# EAGLE board icyradio-main (EAGLE 9.6.2), part 1 of 6
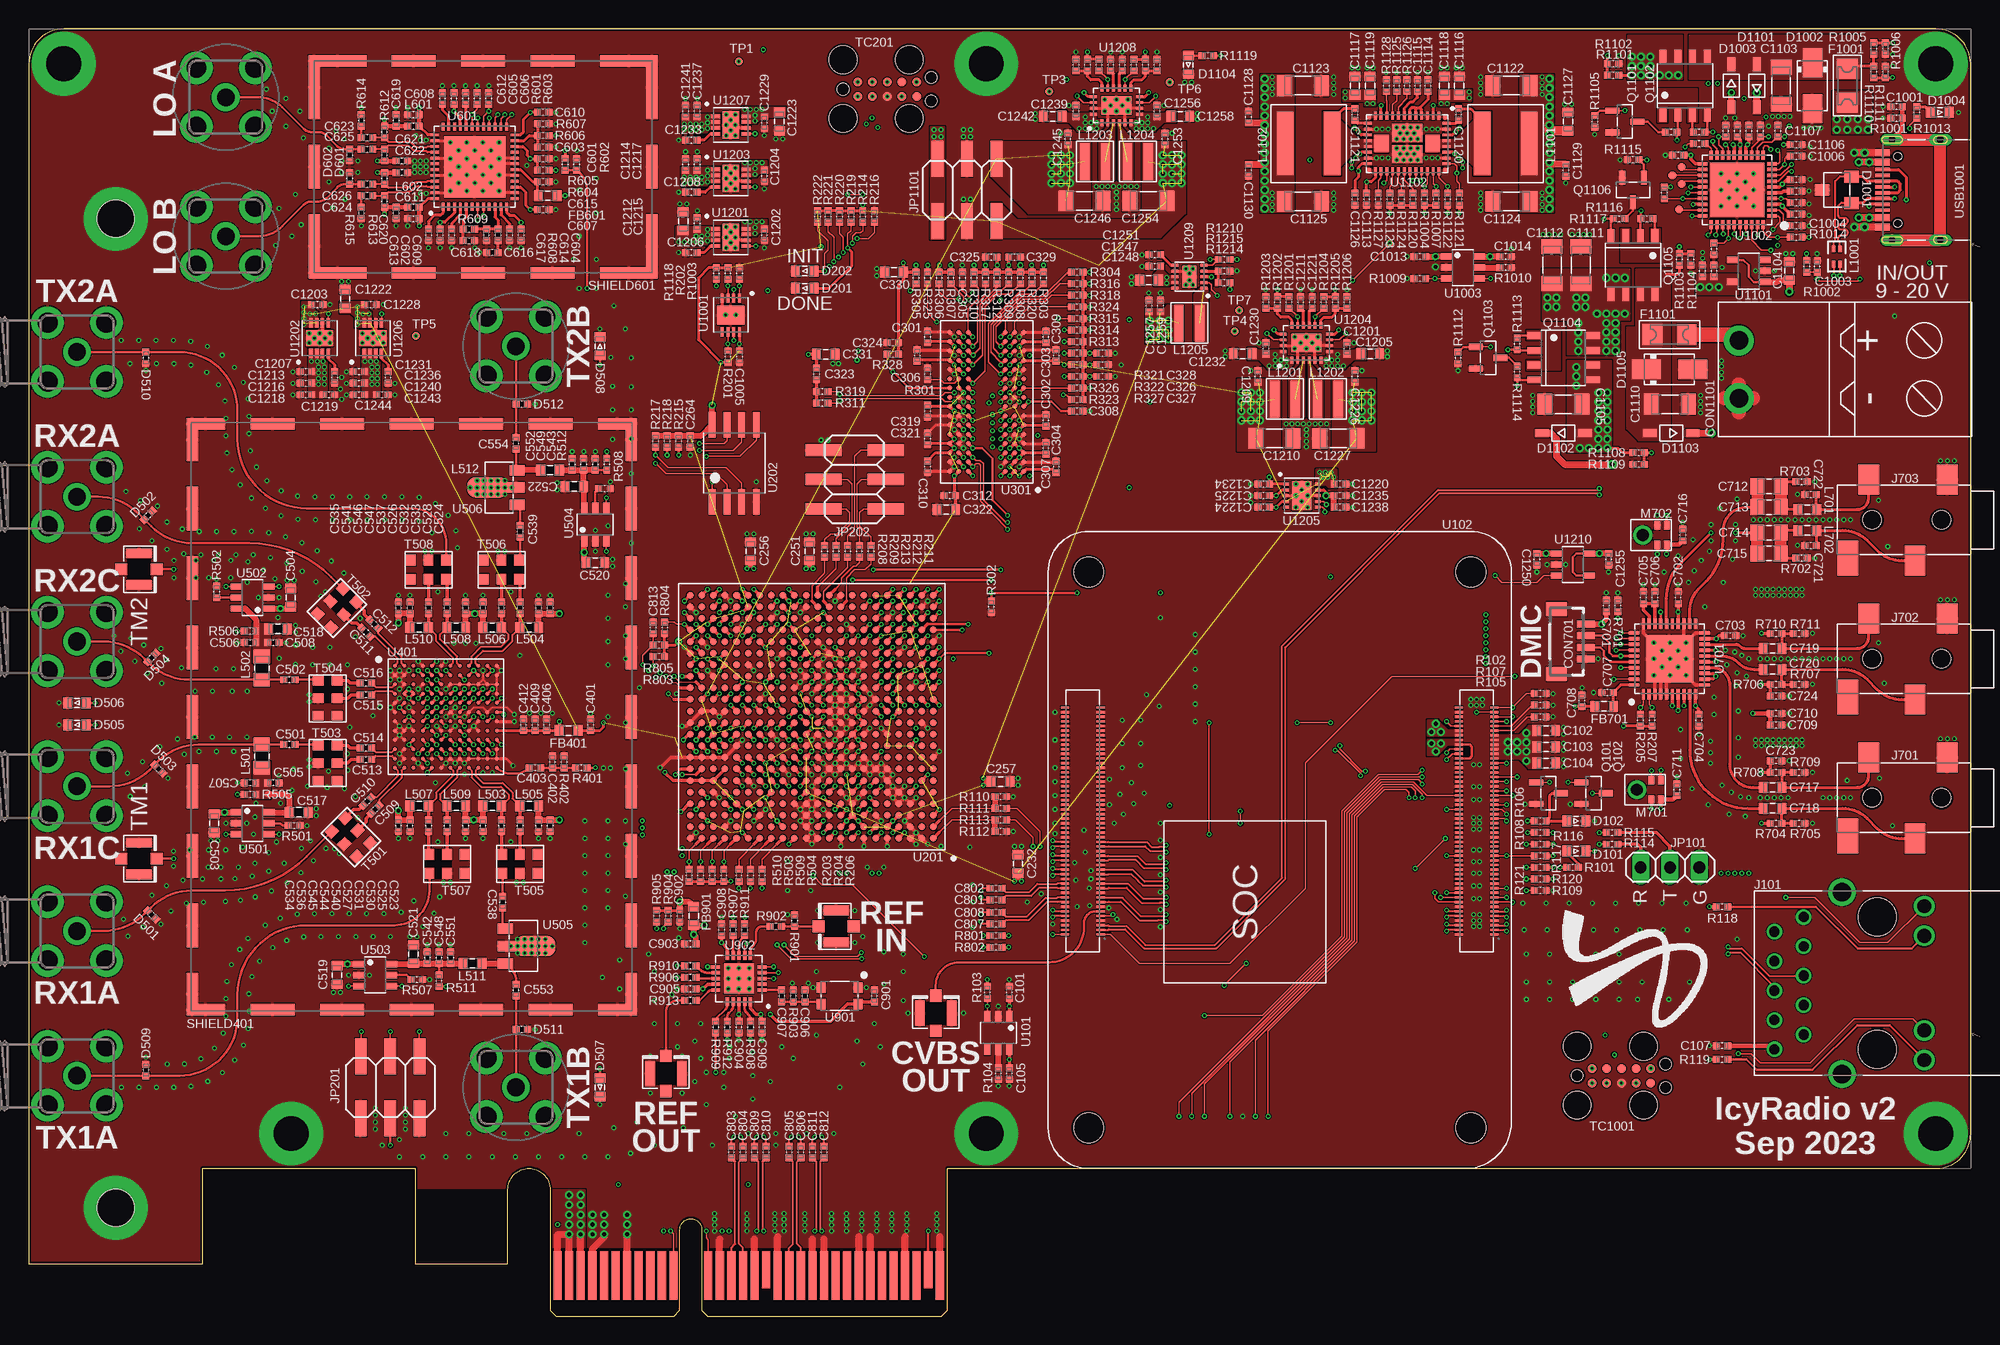
[diagram p26: board, top side]
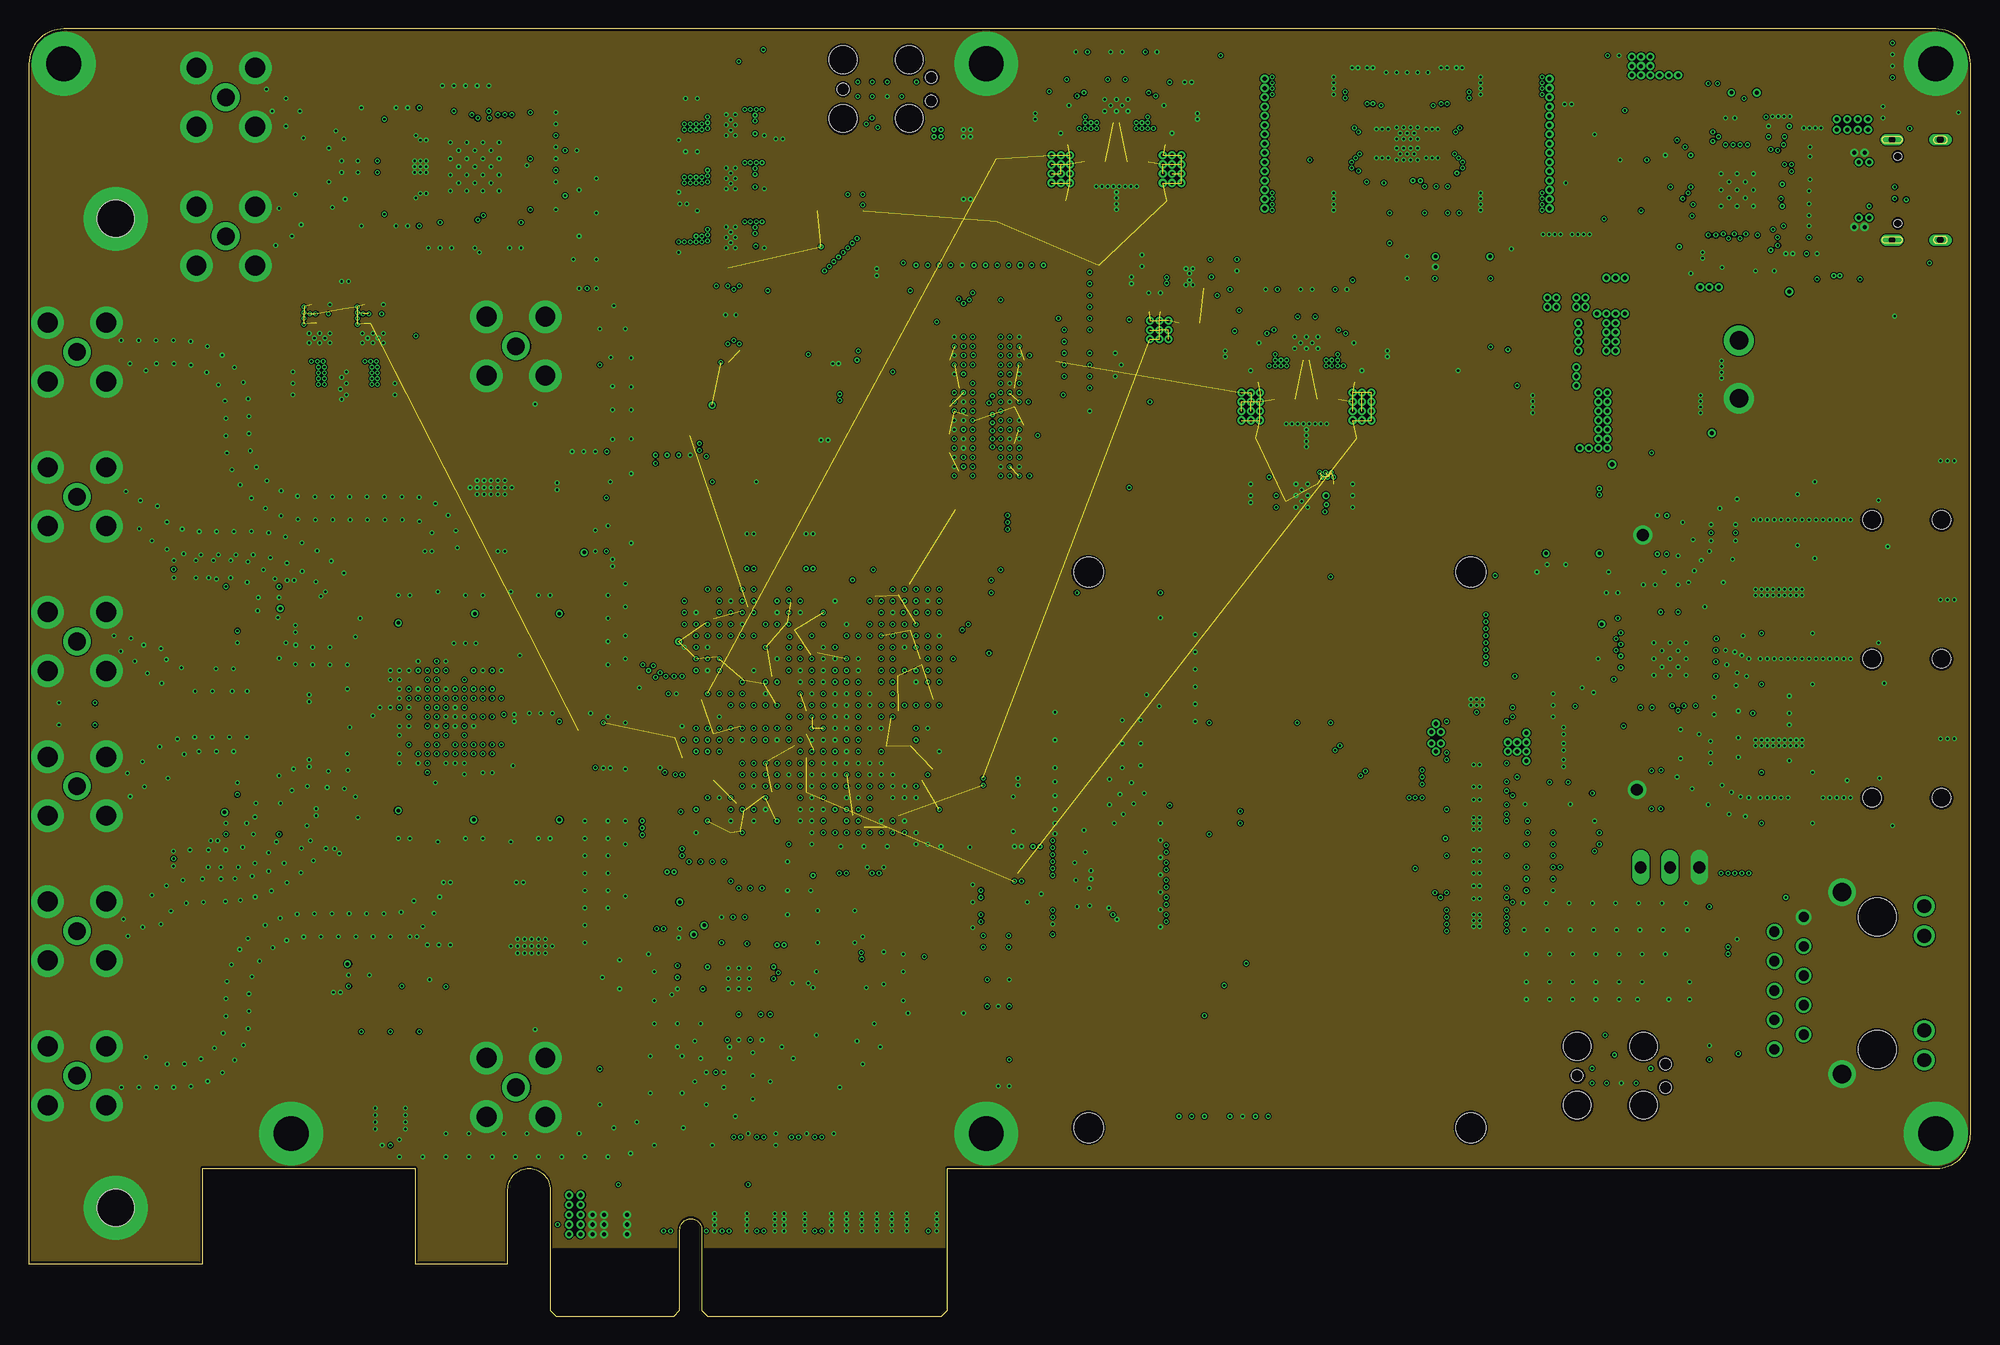
[diagram p27: board, inner layer Route2]
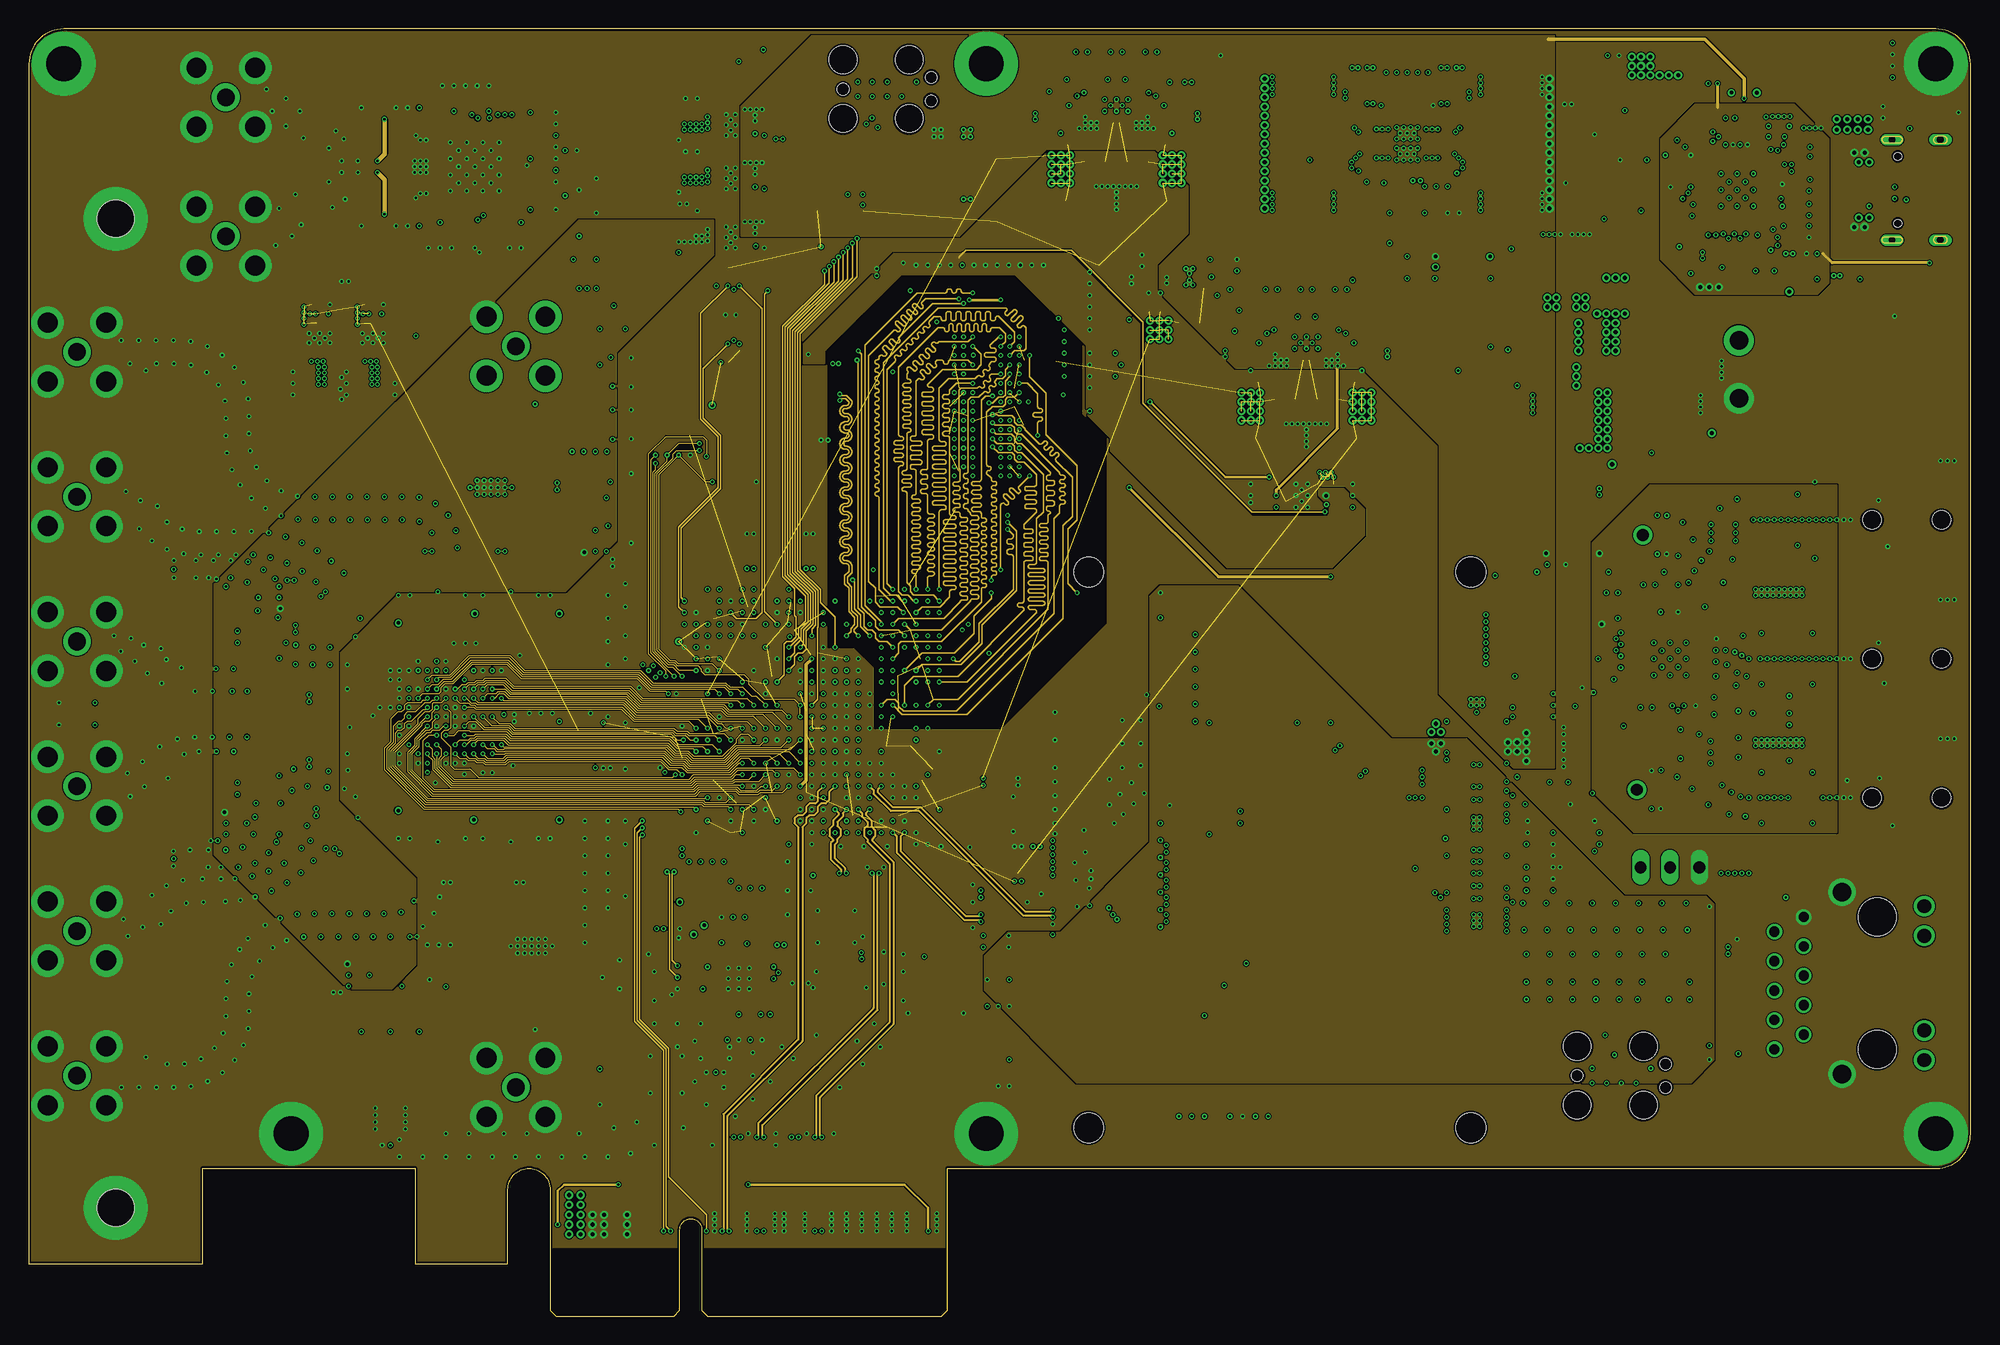
[diagram p28: board, inner layer Route3]
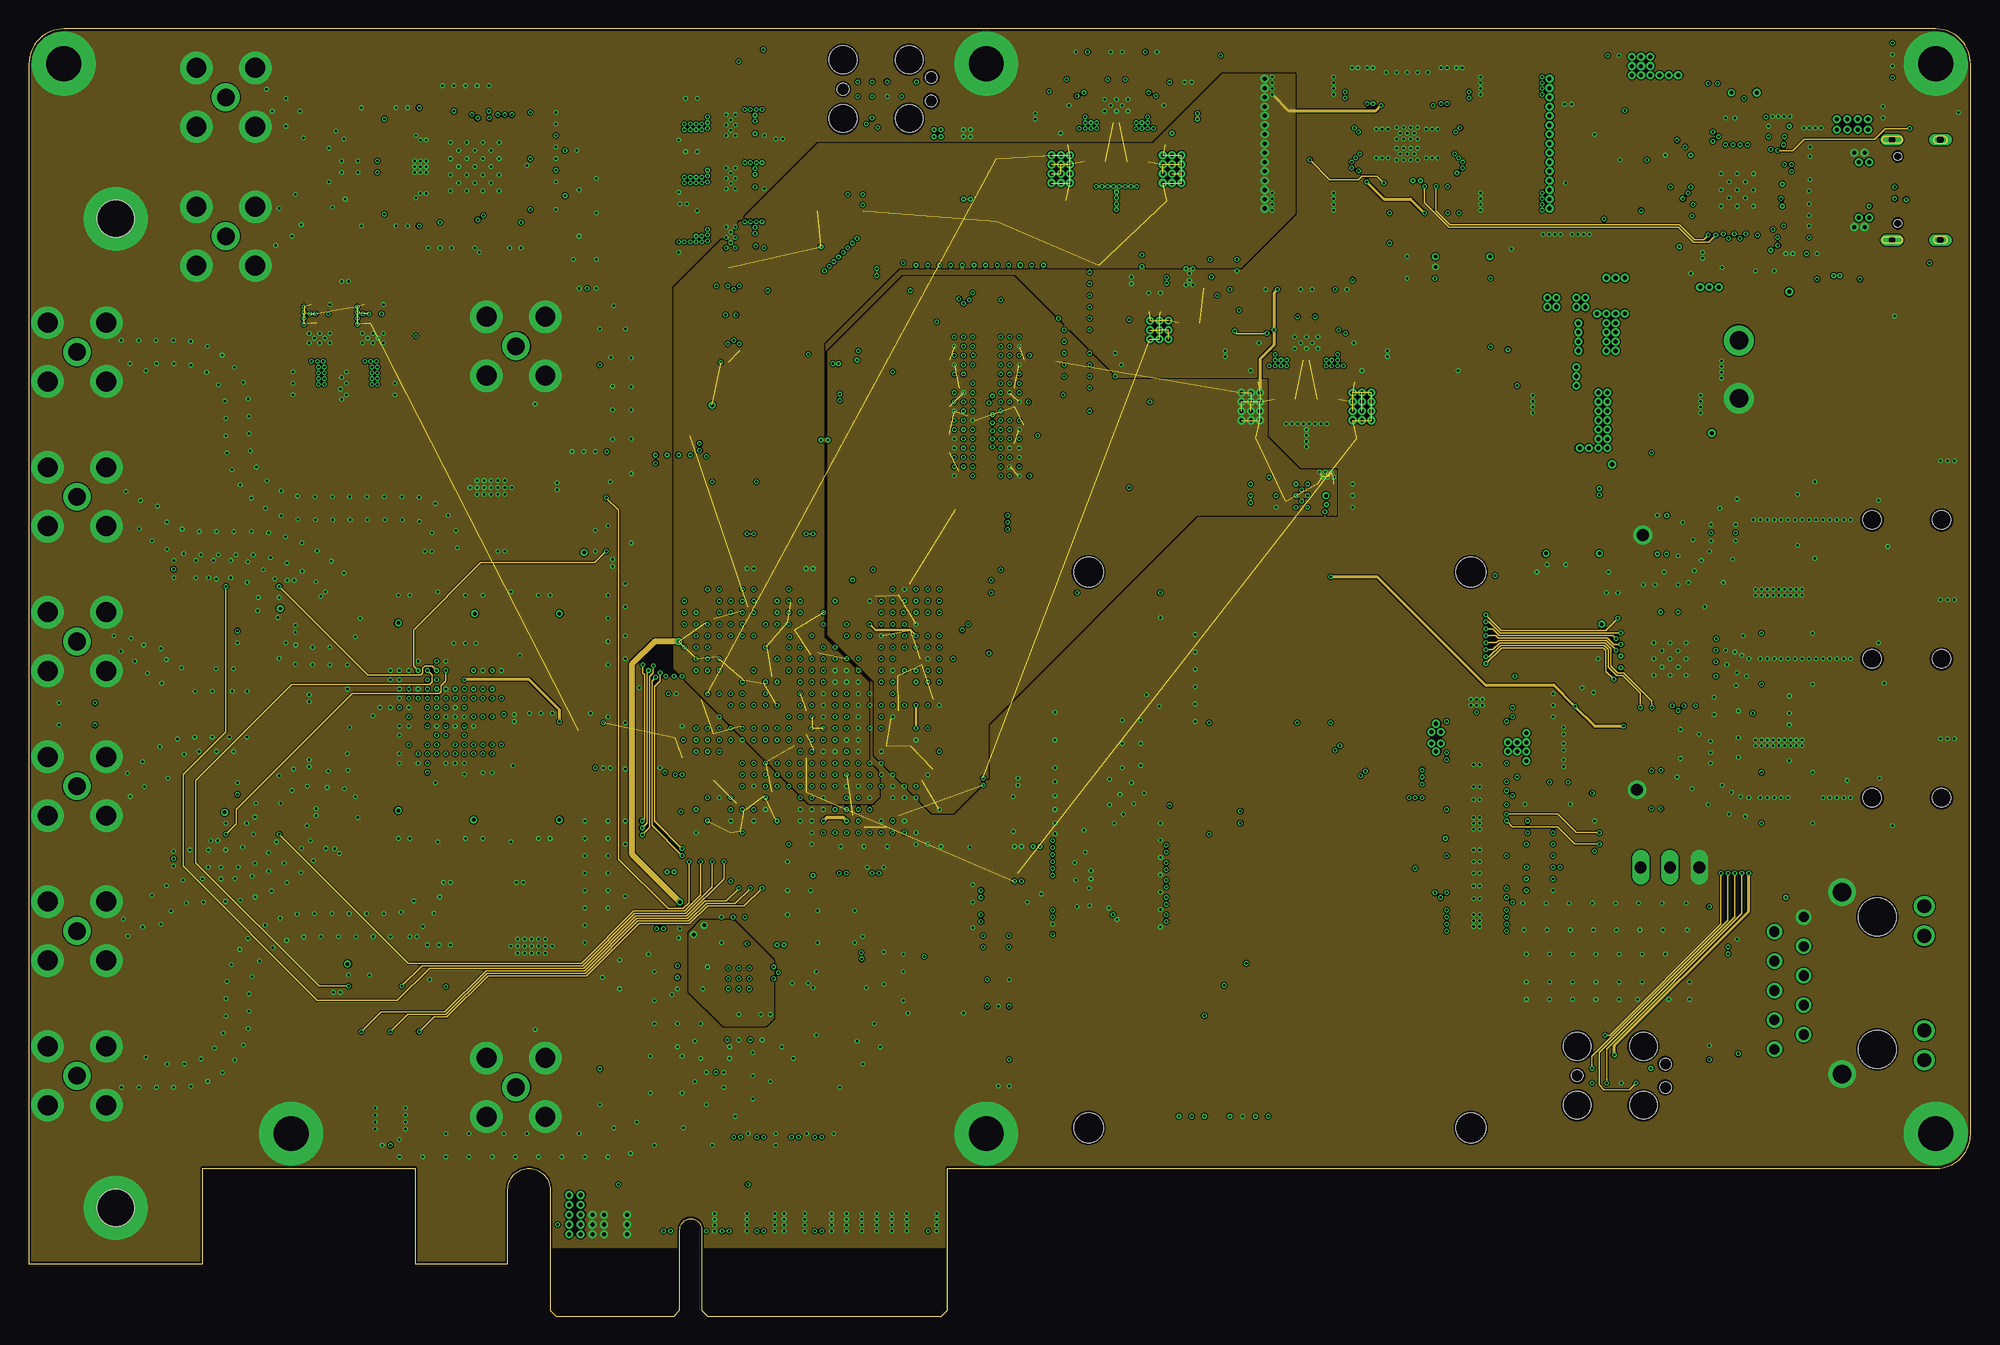
[diagram p29: board, inner layer Route14]
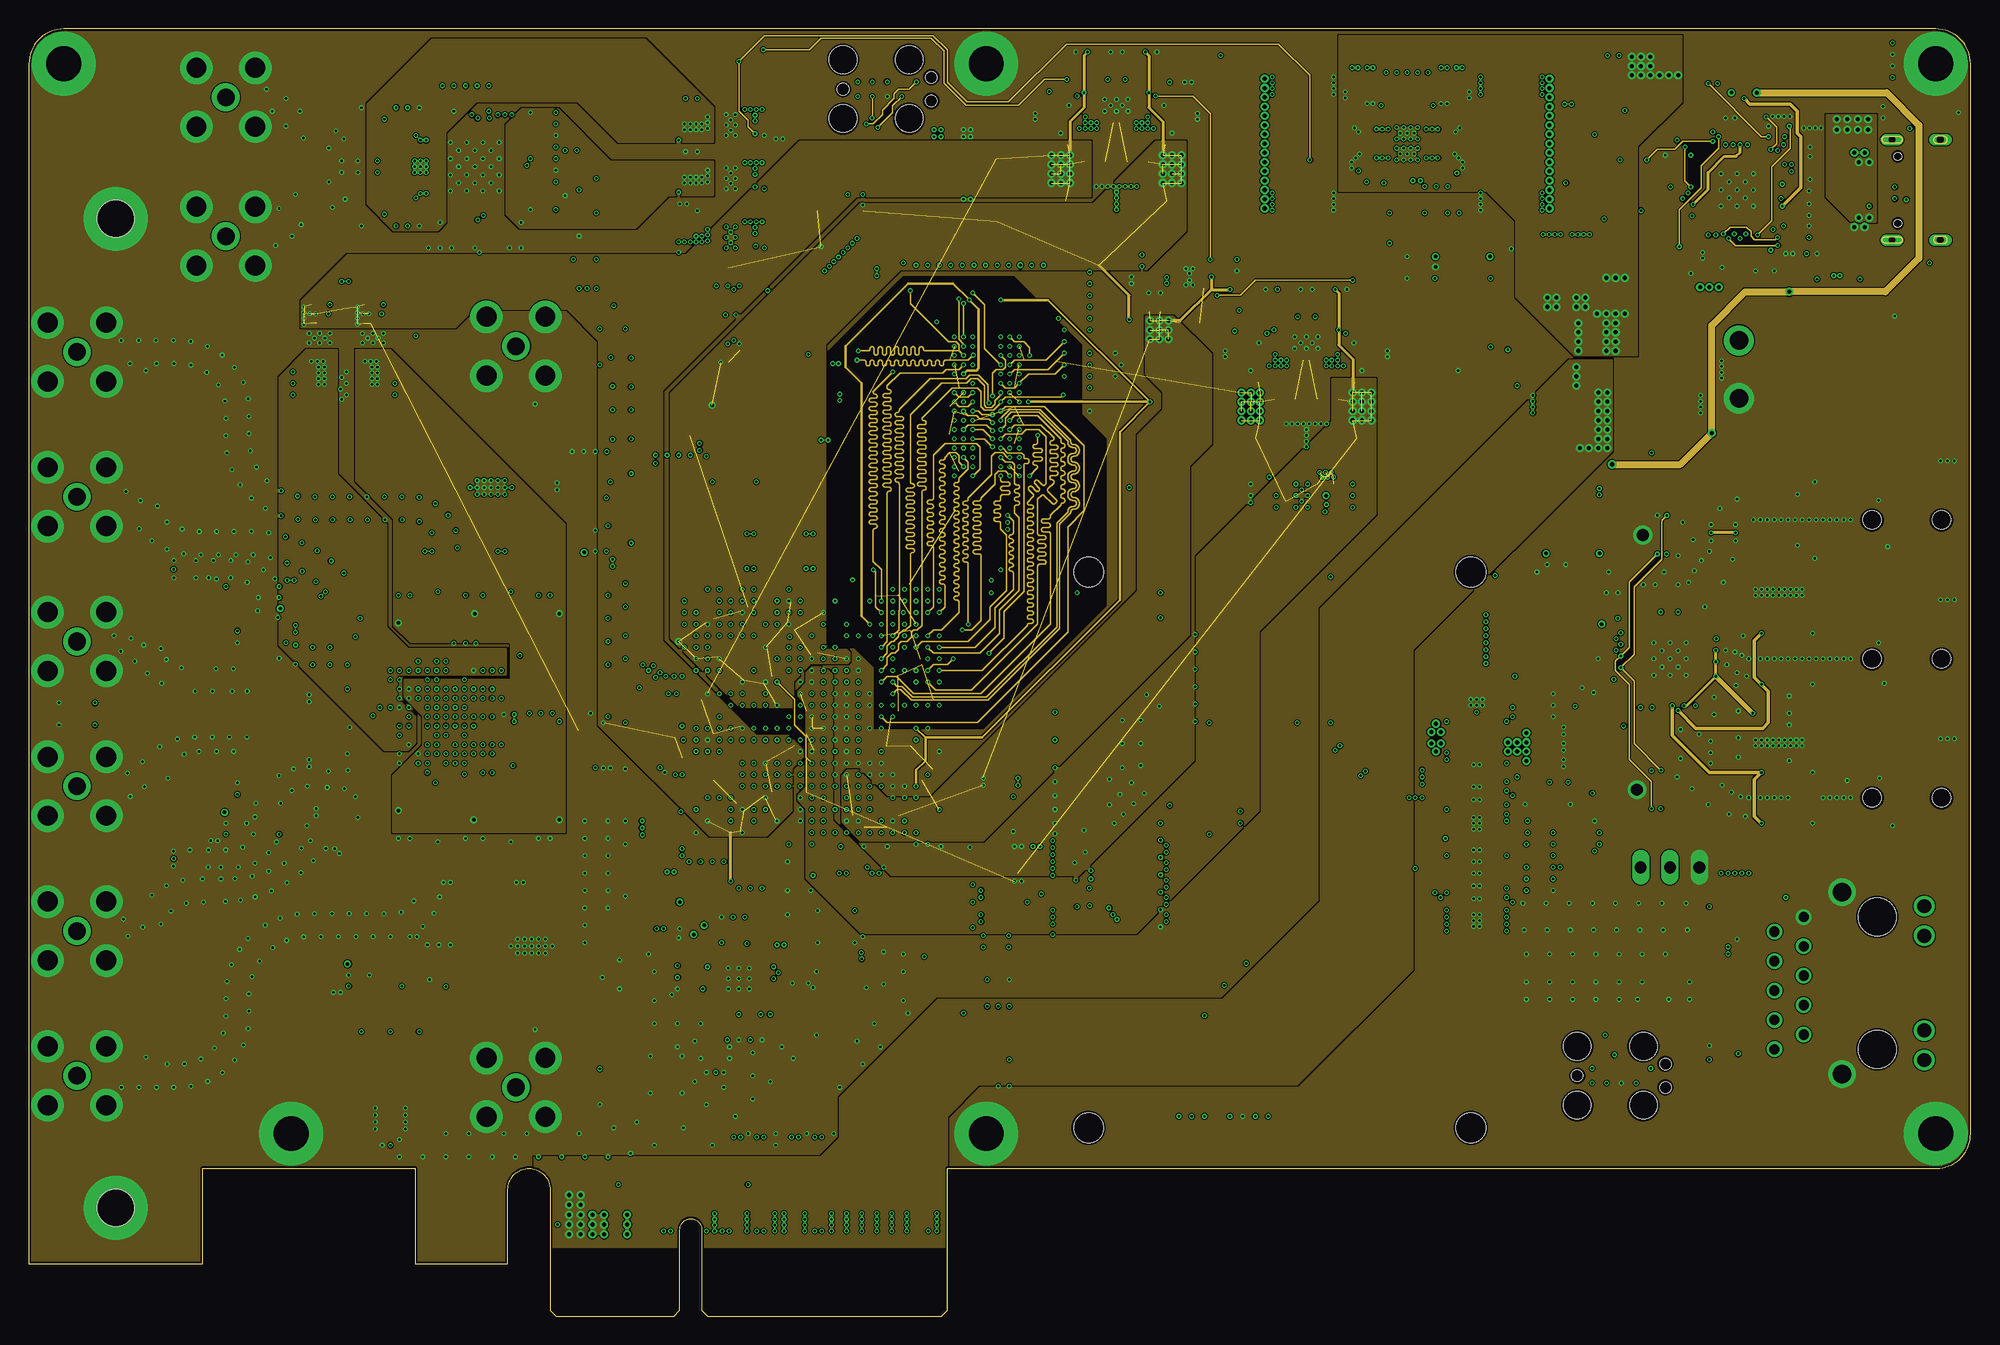
[diagram p30: board, inner layer Route15]
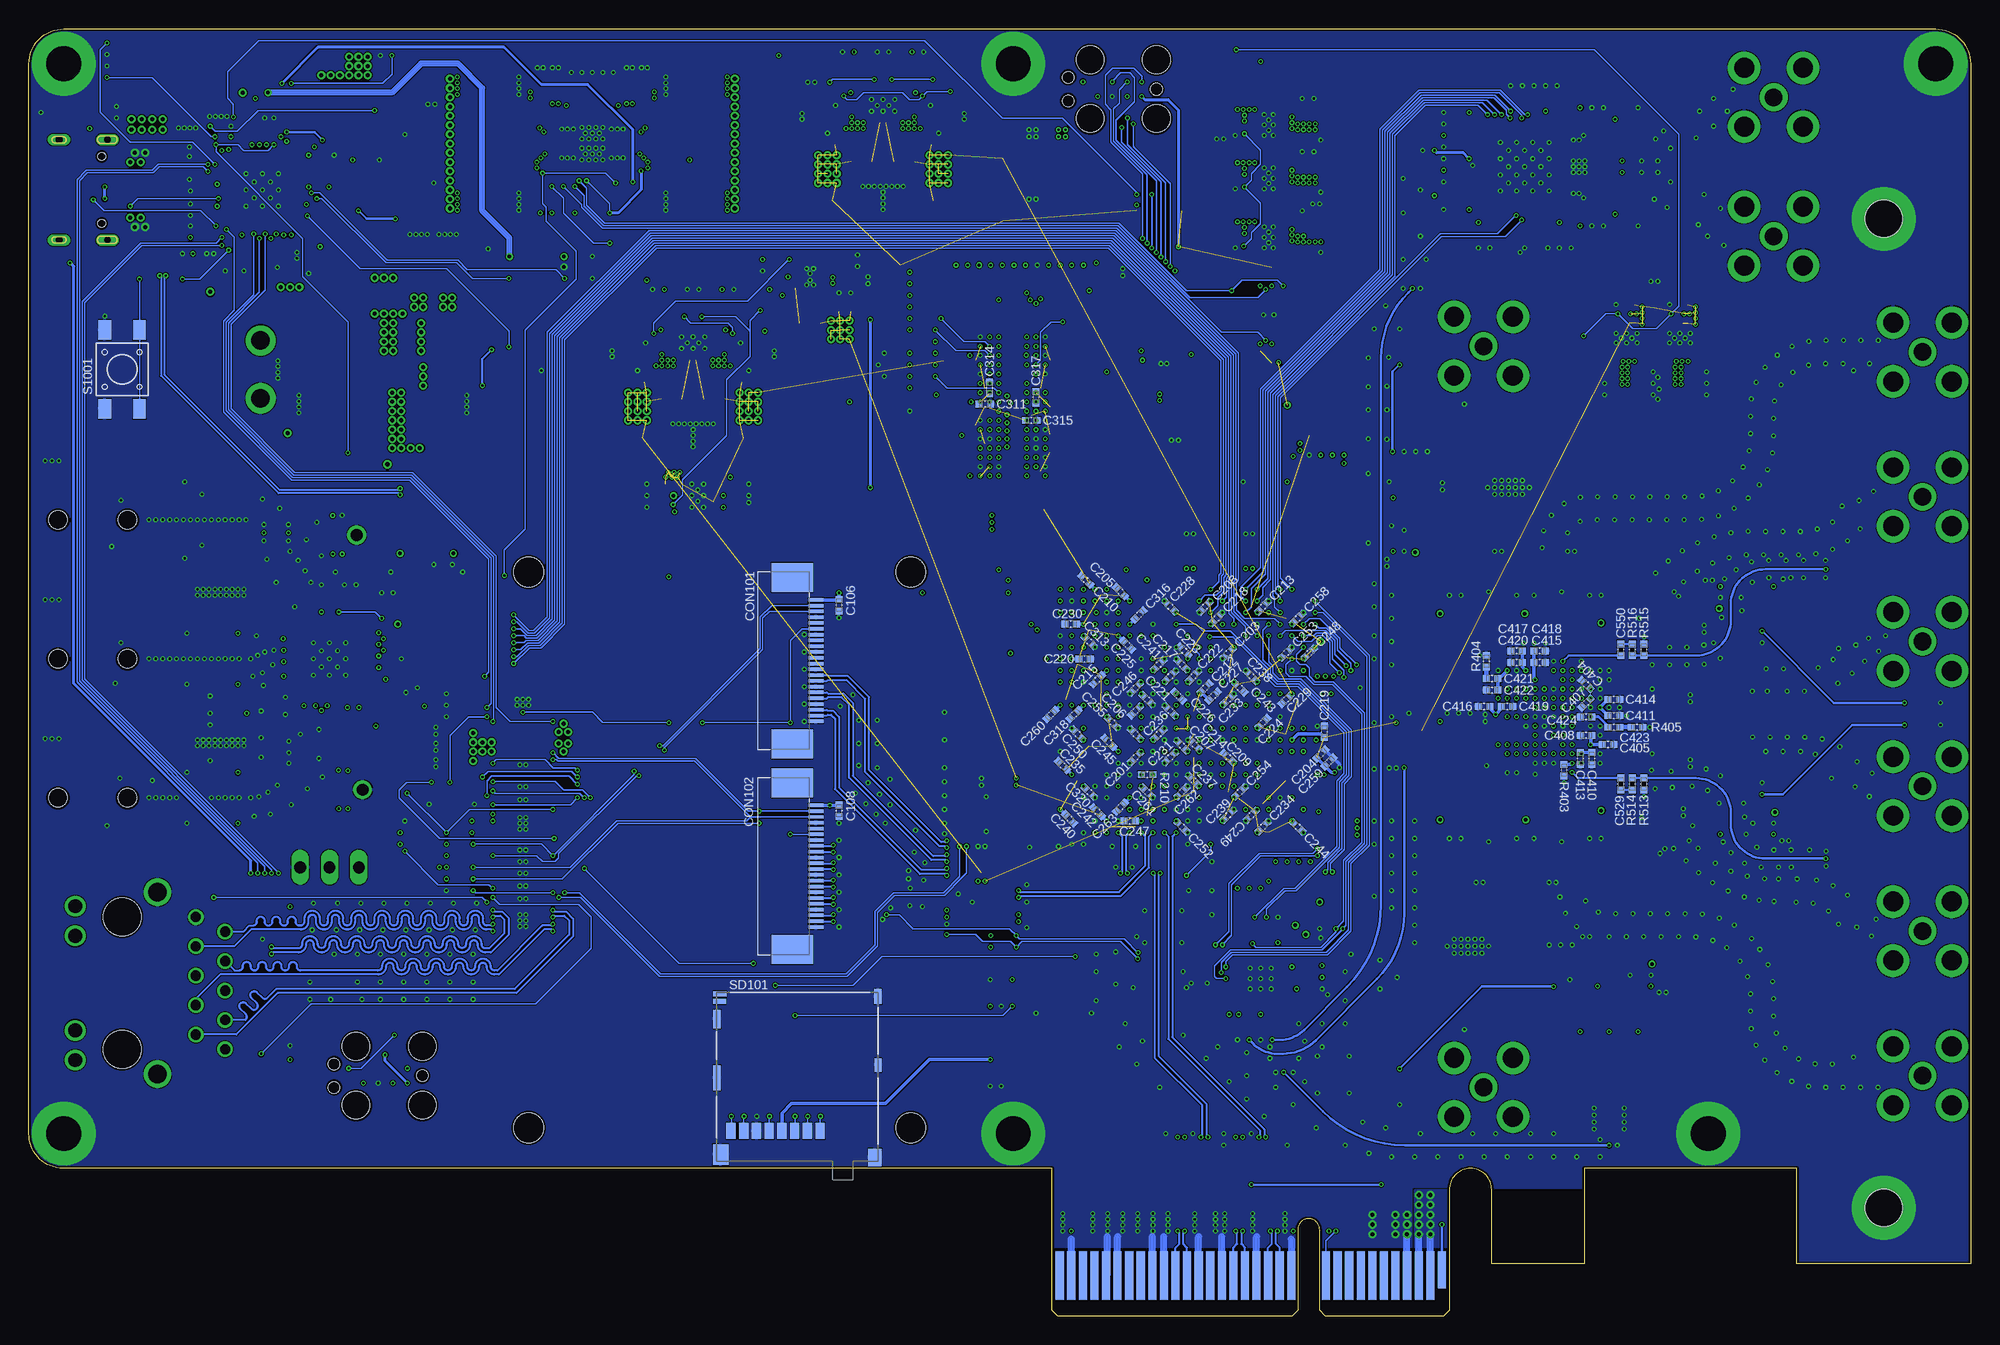
[diagram p31: board, bottom side, seen from below]

Size 167.65 x 111.15 mm. Coordinates in mm from the lower left corner, seen from the top.
Outline: 167.65,15.75 167.65,108.15 arc90 164.65,111.15 3,111.15 arc90 0,108.15 0,4.5 15,4.5 15,12.75 33.35,12.75 33.35,4.5 41.35,4.5 41.35,10.93 arc-90 43.17,12.75 arc-90 45,10.93 45,0.5 45.5,0 55.7,0 56.2,0.5 56.2,7.45 arc-90 57.15,8.4 arc-90 58.1,7.45 58.1,0.5 58.6,0 78.8,0 79.3,0.5 79.3,12.75 164.7,12.75 arc90 167.65,15.75
Copper layers (1+2*3+14*15+16): Top 0.035mm / dielectric 0.0994mm / Route2 0.0152mm / dielectric 0.55mm / Route3 0.0152mm / dielectric 0.1088mm / Route14 0.0152mm / dielectric 0.55mm / Route15 0.0152mm / dielectric 0.0994mm / Bottom 0.035mm
Design rules "jlcpcb_6layer": minimum track width 3.5mil, minimum drill 0.2mm, track to track 3.5mil, track to pad 3.5mil, pad to pad 3.5mil, via to via 5mil, smd to smd 0mil, copper to edge 0.2mm, drill to drill 5mil, minimum pad ring 0.15mm, minimum via ring 0.1mm, stop-mask expansion 0.04mm, vias tented up to drill 10mm, thermal gap 3.5mil
Net classes: 1 CPWG 50 Ohm Single-Ended: width 0.2 mm, clearance 0.127 mm to class 0, clearance 0.127 mm; 2 CPWG 90 Ohm Differential: width 0.152 mm, clearance 0.2 mm to class 0, clearance 0.2 mm to class 1, clearance 0.127 mm; 3 CPWG 100 Ohm Differential: width 0.152 mm, clearance 0.2 mm to class 0, clearance 0.2 mm to class 1, clearance 0.2 mm to class 2, clearance 0.2 mm; 4 Stripline 50 Ohm Single-Ended: width 0.127 mm; 5 Stripline 100 Ohm Differential: width 0.127 mm, clearance 0.127 mm
tRestrict: area 33.3,43.5 to 34.1,44.5; area 36.5,43.5 to 37.3,44.5; area 39.6,43.5 to 40.4,44.5; area 42.8,43.5 to 43.6,44.5; area 34.2,42.1 to 34.8,42.6; area 35.8,42.1 to 36.4,42.6; area 40.5,42.1 to 41.1,42.6; area 42.1,42.1 to 42.7,42.6; area 29.5,43.4 to 30.3,44.1; area 28.8,44.1 to 29.6,44.8; area 37.8,93.5 to 38.2,94.1; area 37.8,92.5 to 38.2,93.1; 92 more areas
bRestrict: area 27.9,45.8 to 28.5,46.2; area 28.9,45.8 to 29.5,46.2; area 29.9,45.8 to 30.5,46.2; area 27.9,57.3 to 28.5,57.8; area 28.9,57.3 to 29.5,57.8; area 29.9,57.3 to 30.5,57.8
vRestrict: 83 lines

## Footprints (pad centres in the part's own frame; a part is rotated, then mirrored left to right if it is on the bottom)
CAP0402 = smd 0.6 x 0.6: 1 -0.5,0; 2 0.5,0
CAP0603 = smd 0.8 x 0.95: 1 -0.8,0; 2 0.8,0
CAP0805 = smd 1.2 x 1.4: 1 -1,0; 2 1,0
CAP1206 = smd 1.3 x 1.8: 1 -1.6,0; 2 1.6,0
FPC-22P = smd 0.3 x 1.3: 1 -5.25,3.5; 2 -4.75,3.5; 3 -4.25,3.5; 4 -3.75,3.5; 5 -3.25,3.5; 6 -2.75,3.5; 7 -2.25,3.5; 8 -1.75,3.5; 9 -1.25,3.5; 10 -0.75,3.5; 11 -0.25,3.5; 12 0.25,3.5; 13 0.75,3.5; 14 1.25,3.5; 15 1.75,3.5; 16 2.25,3.5; 17 2.75,3.5; 18 3.25,3.5; 19 3.75,3.5; 20 4.25,3.5; 21 4.75,3.5; 22 5.25,3.5 | smd 2.5 x 3.6: M1 7.19,1.45; M2 -7.19,1.45
SH-04-TOP = smd 0.6 x 1.55: 1 1.5,-1.625; 2 0.5,-1.625; 3 -0.5,-1.625; 4 -1.5,-1.625 | smd 1.2 x 1.8: FIT@1 2.8,0.9; FIT@2 -2.8,0.9
PCIE-X4-EDGE = smd 0.7 x 3.2 bottom: A1 -11.5,-4.4 | smd 0.7 x 4.2 bottom: A2 -10.5,-4.9; A3 -9.5,-4.9; A4 -8.5,-4.9; A5 -7.5,-4.9; A6 -6.5,-4.9; A7 -5.5,-4.9; A8 -4.5,-4.9; A9 -3.5,-4.9; A10 -2.5,-4.9; A11 -1.5,-4.9; A12 1.5,-4.9; A13 2.5,-4.9; A14 3.5,-4.9; A15 4.5,-4.9; A16 5.5,-4.9; A17 6.5,-4.9; A18 7.5,-4.9; A19 8.5,-4.9; A20 9.5,-4.9; A21 10.5,-4.9; A22 11.5,-4.9; A23 12.5,-4.9; A24 13.5,-4.9; A25 14.5,-4.9; A26 15.5,-4.9; A27 16.5,-4.9; A28 17.5,-4.9; A29 18.5,-4.9; A30 19.5,-4.9; A31 20.5,-4.9; A32 21.5,-4.9 | smd 0.7 x 4.2: B1 -11.5,-4.9; B2 -10.5,-4.9; B3 -9.5,-4.9; B4 -8.5,-4.9; B5 -7.5,-4.9; B6 -6.5,-4.9; B7 -5.5,-4.9; B8 -4.5,-4.9; B9 -3.5,-4.9; B10 -2.5,-4.9; B11 -1.5,-4.9; B12 1.5,-4.9; B13 2.5,-4.9; B14 3.5,-4.9; B15 4.5,-4.9; B16 5.5,-4.9; B18 7.5,-4.9; B19 8.5,-4.9; B20 9.5,-4.9; B21 10.5,-4.9; B22 11.5,-4.9; B23 12.5,-4.9; B24 13.5,-4.9; B25 14.5,-4.9; B26 15.5,-4.9; B27 16.5,-4.9; B28 17.5,-4.9; B29 18.5,-4.9; B30 19.5,-4.9; B32 21.5,-4.9 | smd 0.7 x 3.2: B17 6.5,-4.4; B31 20.5,-4.4 | hole 3.18: -49.65,0.95; -49.65,86.35
2EDG-2P-5MM-H = drill 1.6 pad 2.6: P$1 -2.5,0; P$2 2.5,0
0603 = smd 0.8 x 0.95: A 0.8,0; C -0.8,0
TVS0402 = smd 0.6 x 0.6: 1 -0.5,0; 2 0.5,0
SOT23 = smd 1.27 x 1.02: 1 -1.27,1.145; 2 -1.27,-1.145; 3 1.27,0
DO214AC = smd 2.5 x 1.7: A 2,0; C -2,0
SOD-123 = smd 1.2 x 0.7: A 1.85,0; C -1.85,0
1206 = smd 1.7 x 1.803: 1 -1.472,0; 2 1.472,0
IND0603 = smd 0.8 x 0.95: 1 -0.8,0; 2 0.8,0
TE-1-2301994-0 = drill 0.89: 1 -8.89,-5.715; 2 -6.35,-4.445; 3 -8.89,-3.175; 4 -6.35,-1.905; 5 -8.89,-0.635; 6 -6.35,0.635; 7 -8.89,1.905; 8 -6.35,3.175; 9 -8.89,4.445; 10 -6.35,5.715 | drill 1.2: 11 4.06,-6.645; 12 4.06,-4.095; 13 4.06,4.095; 14 4.06,6.645 | drill 1.6: SHIELD@0 -3.05,-7.855; SHIELD@1 -3.05,7.855 | hole 3.25: 0,-5.715; 0,5.715
3.5TRSJACK = smd 1.8 x 2.6: 1 2,-3.5; 2 8.8,-3.5; 3 4.8,3.5 | smd 1.8 x 3: 4 10.6,3.3 | hole 1.6: 2.5,0; 8.5,0
1X03 = drill 1.016 long: 1 -2.54,0; 2 0,0; 3 2.54,0
2X03/SMD = smd 1.02 x 3.12: 1 -2.54,-2.69; 2 -2.54,2.69; 3 0,-2.69; 4 0,2.69; 5 2.54,-2.69; 6 2.54,2.69
IND0805 = smd 1.2 x 1.4: 1 -1,0; 2 1,0
IND0402 = smd 0.6 x 0.6: 1 -0.5,0; 2 0.5,0
0603USB = smd 0.58 x 0.3: 1 -0.655,0.275; 2 0.655,0.275; 3 0.655,-0.275; 4 -0.655,-0.275
XGL6030 = smd 1.43 x 5.5: 1 -2.02,0; 2 2.02,0
XGL35XX = smd 0.81 x 3.2: 1 -0.9,0; 2 0.9,0
SPH0641LM4H-1 = smd 0.725 x 0.522: 1 -0.838,2.074; 2 -0.838,1.252; 4 0.838,1.252; 5 0.838,2.074 | drill 1.025 pad 1.625: 3 0,0
SOT23' = smd 1.219 x 0.533: 1 -1.067,0.94; 2 -1.067,-0.94; 3 1.067,0
SOIC8 = smd 0.6 x 1.194: 1 -1.905,-2.527; 2 -0.635,-2.527; 3 0.635,-2.527; 4 1.905,-2.527; 5 1.905,2.527; 6 0.635,2.527; 7 -0.635,2.527; 8 -1.905,2.527
RES0402 = smd 0.6 x 0.6: 1 -0.5,0; 2 0.5,0
U.FL = smd 2.2 x 0.85: P$1 0,1.375; P$2 0,-1.375 | smd 1.05 x 1: P$3 1.525,0; P$4 -1.525,0
SMA-RA = drill 1.72 pad 2.8: GND@0 -2.54,2.54; GND@1 2.54,2.54; GND@2 -2.54,-2.54; GND@3 2.54,-2.54 | drill 1.52 pad 2.4: SIGNAL 0,0
SMA = drill 1.72 pad 2.8: GND@0 -2.54,2.54; GND@1 2.54,2.54; GND@2 -2.54,-2.54; GND@3 2.54,-2.54 | drill 1.52 pad 2.4: SIGNAL 0,0
TAC_SW_SMD_4.5X4.5 = smd 1.7 x 1.1: 1 -3.4,1.5; 2 3.4,1.5; 3 -3.4,-1.5; 4 3.4,-1.5
TE-2201778-1 = smd 0.8 x 1.4: 1 1.965,-4.75; 2 0.865,-4.75; 3 -0.235,-4.75; 4 -1.335,-4.75; 5 -2.435,-4.75; 6 -3.535,-4.75; 7 -4.635,-4.75; 8 -5.735,-4.75 | smd 1.15 x 0.45: 9 -6.7,7.075 | smd 1.1 x 0.45: 10 -6.725,6.415 | smd 1.35 x 1.8: 11 -6.625,-6.8 | smd 0.65 x 2.14: 12 -6.95,-0.17 | smd 0.65 x 1.6: 13 -6.95,4.91 | smd 0.65 x 1.3: 14 6.95,6.85 | smd 0.6 x 1.15: 15 6.975,0.925 | smd 1.16 x 1.5: 16 6.695,-7.05
2118732 = smd 3.7 x 1: 1 1.85,0.5; 9 49.75,0.5; 17 49.75,38.4; 25 1.85,38.4 | smd 3.8 x 1: 2 7.8,0.5; 3 43.8,0.5; 4 13.8,0.5; 5 19.8,0.5; 6 25.8,0.5; 7 31.8,0.5; 8 37.8,0.5; 18 43.8,38.4; 19 7.8,38.4; 20 37.8,38.4; 21 31.8,38.4; 22 25.8,38.4; 23 19.8,38.4; 24 13.8,38.4 | smd 1 x 3.35: 10 51.1,1.675; 16 51.1,37.225; 26 0.5,37.225; 32 0.5,1.675 | smd 1 x 3.8: 11 51.1,7.45; 12 51.1,13.45; 13 51.1,19.45; 14 51.1,25.45; 15 51.1,31.45; 27 0.5,31.45; 28 0.5,25.45; 29 0.5,19.45; 30 0.5,13.45; 31 0.5,7.45
2118728 = smd 5 x 1: 1 2.5,0.5; 5 27.66,0.5; 9 27.66,18.8; 13 2.5,18.8 | smd 3.8 x 1: 2 9.08,0.5; 3 15.08,0.5; 4 21.08,0.5; 10 21.08,18.8; 11 15.08,18.8; 12 9.08,18.8 | smd 1 x 5.55: 6 29.66,2.775; 8 29.66,16.525; 14 0.5,16.525; 16 0.5,2.775 | smd 1 x 3.8: 7 29.66,9.65; 15 0.5,9.65
UWB1 = smd 0.84 x 0.94: 1 1.52,-0.825; 2 0,-0.825; 3 -1.52,-0.825; 4 -1.52,0.825; 5 0,0.825; 6 1.52,0.825
TC2050-IDC = smd 0.787 x 0.787: 1 -2.54,-0.635; 2 -1.27,-0.635; 3 0,-0.635; 4 1.27,-0.635; 5 2.54,-0.635; 6 2.54,0.635; 7 1.27,0.635; 8 0,0.635; 9 -1.27,0.635; 10 -2.54,0.635 | hole 0.991: -3.81,0; 3.81,1.016; 3.81,-1.016 | hole 2.375: -3.81,2.54; -3.81,-2.54; 1.905,2.54; 1.905,-2.54
PAD0.7MM = smd 0.7 x 0.7: TP 0,0
SOT23-6 = smd 1 x 0.55: 1 -1.4,0.95; 2 -1.4,0; 3 -1.4,-0.95; 4 1.4,-0.95; 5 1.4,0; 6 1.4,0.95
RPI-CM4 = smd 0.2 x 0.7: 1 34.8,38.54; 2 34.8,35.46; 3 34.4,38.54; 4 34.4,35.46; 5 34,38.54; 6 34,35.46; 7 33.6,38.54; 8 33.6,35.46; 9 33.2,38.54; 10 33.2,35.46; 11 32.8,38.54; 12 32.8,35.46; 13 32.4,38.54; 14 32.4,35.46; 15 32,38.54; 16 32,35.46; 17 31.6,38.54; 18 31.6,35.46; 19 31.2,38.54; 20 31.2,35.46; 21 30.8,38.54; 22 30.8,35.46; 23 30.4,38.54; 24 30.4,35.46; 25 30,38.54; 26 30,35.46; 27 29.6,38.54; 28 29.6,35.46; 29 29.2,38.54; 30 29.2,35.46; 31 28.8,38.54; 32 28.8,35.46; 33 28.4,38.54; 34 28.4,35.46; 35 28,38.54; 36 28,35.46; 37 27.6,38.54; 38 27.6,35.46; 39 27.2,38.54; 40 27.2,35.46; 41 26.8,38.54; 42 26.8,35.46; 43 26.4,38.54; 44 26.4,35.46; 45 26,38.54; 46 26,35.46; 47 25.6,38.54; 48 25.6,35.46; 49 25.2,38.54; 50 25.2,35.46; 51 24.8,38.54; 52 24.8,35.46; 53 24.4,38.54; 54 24.4,35.46; 55 24,38.54; 56 24,35.46; 57 23.6,38.54; 58 23.6,35.46; 59 23.2,38.54; 60 23.2,35.46; 61 22.8,38.54; 62 22.8,35.46; 63 22.4,38.54; 64 22.4,35.46; 65 22,38.54; 66 22,35.46; 67 21.6,38.54; 68 21.6,35.46; 69 21.2,38.54; 70 21.2,35.46; 71 20.8,38.54; 72 20.8,35.46; 73 20.4,38.54; 74 20.4,35.46; 75 20,38.54; 76 20,35.46; 77 19.6,38.54; 78 19.6,35.46; 79 19.2,38.54; 80 19.2,35.46; 81 18.8,38.54; 82 18.8,35.46; 83 18.4,38.54; 84 18.4,35.46; 85 18,38.54; 86 18,35.46; 87 17.6,38.54; 88 17.6,35.46; 89 17.2,38.54; 90 17.2,35.46; 91 16.8,38.54; 92 16.8,35.46; 93 16.4,38.54; 94 16.4,35.46; 95 16,38.54; 96 16,35.46; 97 15.6,38.54; 98 15.6,35.46; 99 15.2,38.54; 100 15.2,35.46; 101 34.8,4.54; 102 34.8,1.46; 103 34.4,4.54; 104 34.4,1.46; 105 34,4.54; 106 34,1.46; 107 33.6,4.54; 108 33.6,1.46; 109 33.2,4.54; 110 33.2,1.46; 111 32.8,4.54; 112 32.8,1.46; 113 32.4,4.54; 114 32.4,1.46; 115 32,4.54; 116 32,1.46; 117 31.6,4.54; 118 31.6,1.46; 119 31.2,4.54; 120 31.2,1.46; 121 30.8,4.54; 122 30.8,1.46; 123 30.4,4.54; 124 30.4,1.46; 125 30,4.54; 126 30,1.46; 127 29.6,4.54; 128 29.6,1.46; 129 29.2,4.54; 130 29.2,1.46; 131 28.8,4.54; 132 28.8,1.46; 133 28.4,4.54; 134 28.4,1.46; 135 28,4.54; 136 28,1.46; 137 27.6,4.54; 138 27.6,1.46; 139 27.2,4.54; 140 27.2,1.46; 141 26.8,4.54; 142 26.8,1.46; 143 26.4,4.54; 144 26.4,1.46; 145 26,4.54; 146 26,1.46; 147 25.6,4.54; 148 25.6,1.46; 149 25.2,4.54; 150 25.2,1.46; 151 24.8,4.54; 152 24.8,1.46; 153 24.4,4.54; 154 24.4,1.46; 155 24,4.54; 156 24,1.46; 157 23.6,4.54; 158 23.6,1.46; 159 23.2,4.54; 160 23.2,1.46; 161 22.8,4.54; 162 22.8,1.46; 163 22.4,4.54; 164 22.4,1.46; 165 22,4.54; 166 22,1.46; 167 21.6,4.54; 168 21.6,1.46; 169 21.2,4.54; 170 21.2,1.46; 171 20.8,4.54; 172 20.8,1.46; 173 20.4,4.54; 174 20.4,1.46; 175 20,4.54; 176 20,1.46; 177 19.6,4.54; 178 19.6,1.46; 179 19.2,4.54; 180 19.2,1.46; 181 18.8,4.54; 182 18.8,1.46; 183 18.4,4.54; 184 18.4,1.46; 185 18,4.54; 186 18,1.46; 187 17.6,4.54; 188 17.6,1.46; 189 17.2,4.54; 190 17.2,1.46; 191 16.8,4.54; 192 16.8,1.46; 193 16.4,4.54; 194 16.4,1.46; 195 16,4.54; 196 16,1.46; 197 15.6,4.54; 198 15.6,1.46; 199 15.2,4.54; 200 15.2,1.46 | hole 2.55: 3.5,3.5; 3.5,36.5; 51.5,36.5; 51.5,3.5
FGG484 = smd 0.6 x 0.6: A1 -10.5,10.5; A2 -9.5,10.5; A3 -8.5,10.5; A4 -7.5,10.5; A5 -6.5,10.5; A6 -5.5,10.5; A7 -4.5,10.5; A8 -3.5,10.5; A9 -2.5,10.5; A10 -1.5,10.5; A11 -0.5,10.5; A12 0.5,10.5; A13 1.5,10.5; A14 2.5,10.5; A15 3.5,10.5; A16 4.5,10.5; A17 5.5,10.5; A18 6.5,10.5; A19 7.5,10.5; A20 8.5,10.5; A21 9.5,10.5; A22 10.5,10.5; AA1 -10.5,-9.5; AA2 -9.5,-9.5; AA3 -8.5,-9.5; AA4 -7.5,-9.5; AA5 -6.5,-9.5; AA6 -5.5,-9.5; AA7 -4.5,-9.5; AA8 -3.5,-9.5; AA9 -2.5,-9.5; AA10 -1.5,-9.5; AA11 -0.5,-9.5; AA12 0.5,-9.5; AA13 1.5,-9.5; AA14 2.5,-9.5; AA15 3.5,-9.5; AA16 4.5,-9.5; AA17 5.5,-9.5; AA18 6.5,-9.5; AA19 7.5,-9.5; AA20 8.5,-9.5; AA21 9.5,-9.5; AA22 10.5,-9.5; AB1 -10.5,-10.5; AB2 -9.5,-10.5; AB3 -8.5,-10.5; AB4 -7.5,-10.5; AB5 -6.5,-10.5; AB6 -5.5,-10.5; AB7 -4.5,-10.5; AB8 -3.5,-10.5; AB9 -2.5,-10.5; AB10 -1.5,-10.5; AB11 -0.5,-10.5; AB12 0.5,-10.5; AB13 1.5,-10.5; AB14 2.5,-10.5; AB15 3.5,-10.5; AB16 4.5,-10.5; AB17 5.5,-10.5; AB18 6.5,-10.5; AB19 7.5,-10.5; AB20 8.5,-10.5; AB21 9.5,-10.5; AB22 10.5,-10.5; B1 -10.5,9.5; B2 -9.5,9.5; B3 -8.5,9.5; B4 -7.5,9.5; B5 -6.5,9.5; B6 -5.5,9.5; B7 -4.5,9.5; B8 -3.5,9.5; B9 -2.5,9.5; B10 -1.5,9.5; B11 -0.5,9.5; B12 0.5,9.5; B13 1.5,9.5; B14 2.5,9.5; B15 3.5,9.5; B16 4.5,9.5; B17 5.5,9.5; B18 6.5,9.5; B19 7.5,9.5; B20 8.5,9.5; B21 9.5,9.5; B22 10.5,9.5; C1 -10.5,8.5; C2 -9.5,8.5; C3 -8.5,8.5; C4 -7.5,8.5; C5 -6.5,8.5; C6 -5.5,8.5; C7 -4.5,8.5; C8 -3.5,8.5; C9 -2.5,8.5; C10 -1.5,8.5; C11 -0.5,8.5; C12 0.5,8.5; C13 1.5,8.5; C14 2.5,8.5; C15 3.5,8.5; C16 4.5,8.5; C17 5.5,8.5; C18 6.5,8.5; C19 7.5,8.5; C20 8.5,8.5; C21 9.5,8.5; C22 10.5,8.5; D1 -10.5,7.5; D2 -9.5,7.5; D3 -8.5,7.5; D4 -7.5,7.5; D5 -6.5,7.5; D6 -5.5,7.5; D7 -4.5,7.5; D8 -3.5,7.5; D9 -2.5,7.5; D10 -1.5,7.5; D11 -0.5,7.5; D12 0.5,7.5; D13 1.5,7.5; D14 2.5,7.5; D15 3.5,7.5; D16 4.5,7.5; D17 5.5,7.5; D18 6.5,7.5; D19 7.5,7.5; D20 8.5,7.5; D21 9.5,7.5; D22 10.5,7.5; E1 -10.5,6.5; E2 -9.5,6.5; E3 -8.5,6.5; E4 -7.5,6.5; E5 -6.5,6.5; E6 -5.5,6.5; E7 -4.5,6.5; E8 -3.5,6.5; E9 -2.5,6.5; E10 -1.5,6.5; E11 -0.5,6.5; E12 0.5,6.5; E13 1.5,6.5; E14 2.5,6.5; E15 3.5,6.5; E16 4.5,6.5; E17 5.5,6.5; E18 6.5,6.5; E19 7.5,6.5; E20 8.5,6.5; E21 9.5,6.5; E22 10.5,6.5; F1 -10.5,5.5; F2 -9.5,5.5; F3 -8.5,5.5; F4 -7.5,5.5; F5 -6.5,5.5; F6 -5.5,5.5; F7 -4.5,5.5; F8 -3.5,5.5; F9 -2.5,5.5; F10 -1.5,5.5; F11 -0.5,5.5; F12 0.5,5.5; F13 1.5,5.5; F14 2.5,5.5; F15 3.5,5.5; F16 4.5,5.5; F17 5.5,5.5; F18 6.5,5.5; F19 7.5,5.5; F20 8.5,5.5; F21 9.5,5.5; F22 10.5,5.5; G1 -10.5,4.5; G2 -9.5,4.5; G3 -8.5,4.5; G4 -7.5,4.5; G5 -6.5,4.5; G6 -5.5,4.5; G7 -4.5,4.5; G8 -3.5,4.5; G9 -2.5,4.5; G10 -1.5,4.5; G11 -0.5,4.5; G12 0.5,4.5; G13 1.5,4.5; G14 2.5,4.5; G15 3.5,4.5; G16 4.5,4.5; G17 5.5,4.5; G18 6.5,4.5; G19 7.5,4.5; G20 8.5,4.5; G21 9.5,4.5; G22 10.5,4.5; H1 -10.5,3.5; H2 -9.5,3.5; H3 -8.5,3.5; H4 -7.5,3.5; H5 -6.5,3.5; H6 -5.5,3.5; H7 -4.5,3.5; H8 -3.5,3.5; H9 -2.5,3.5; H10 -1.5,3.5; H11 -0.5,3.5; H12 0.5,3.5; H13 1.5,3.5; H14 2.5,3.5; H15 3.5,3.5; H16 4.5,3.5; H17 5.5,3.5; H18 6.5,3.5; H19 7.5,3.5; H20 8.5,3.5; H21 9.5,3.5; H22 10.5,3.5; J1 -10.5,2.5; J2 -9.5,2.5; J3 -8.5,2.5; J4 -7.5,2.5; J5 -6.5,2.5; J6 -5.5,2.5; J7 -4.5,2.5; J8 -3.5,2.5; J9 -2.5,2.5; J10 -1.5,2.5; J11 -0.5,2.5; J12 0.5,2.5; J13 1.5,2.5; J14 2.5,2.5; J15 3.5,2.5; J16 4.5,2.5; J17 5.5,2.5; J18 6.5,2.5; J19 7.5,2.5; J20 8.5,2.5; J21 9.5,2.5; J22 10.5,2.5; K1 -10.5,1.5; K2 -9.5,1.5; K3 -8.5,1.5; K4 -7.5,1.5; K5 -6.5,1.5; K6 -5.5,1.5; K7 -4.5,1.5; K8 -3.5,1.5; K9 -2.5,1.5; K10 -1.5,1.5; K11 -0.5,1.5; K12 0.5,1.5; K13 1.5,1.5; K14 2.5,1.5; K15 3.5,1.5; K16 4.5,1.5; K17 5.5,1.5; K18 6.5,1.5; K19 7.5,1.5; K20 8.5,1.5; K21 9.5,1.5; K22 10.5,1.5; L1 -10.5,0.5; L2 -9.5,0.5; L3 -8.5,0.5; L4 -7.5,0.5; L5 -6.5,0.5; L6 -5.5,0.5; L7 -4.5,0.5; L8 -3.5,0.5; L9 -2.5,0.5; L10 -1.5,0.5; L11 -0.5,0.5; L12 0.5,0.5; L13 1.5,0.5; L14 2.5,0.5; L15 3.5,0.5; L16 4.5,0.5; L17 5.5,0.5; L18 6.5,0.5; L19 7.5,0.5; L20 8.5,0.5; L21 9.5,0.5; L22 10.5,0.5; M1 -10.5,-0.5; M2 -9.5,-0.5; M3 -8.5,-0.5; M4 -7.5,-0.5; M5 -6.5,-0.5; M6 -5.5,-0.5; M7 -4.5,-0.5; M8 -3.5,-0.5; M9 -2.5,-0.5; M10 -1.5,-0.5; M11 -0.5,-0.5; M12 0.5,-0.5; M13 1.5,-0.5; M14 2.5,-0.5; M15 3.5,-0.5; M16 4.5,-0.5; M17 5.5,-0.5; M18 6.5,-0.5; M19 7.5,-0.5; M20 8.5,-0.5; M21 9.5,-0.5; M22 10.5,-0.5; N1 -10.5,-1.5; N2 -9.5,-1.5; N3 -8.5,-1.5; N4 -7.5,-1.5; N5 -6.5,-1.5; N6 -5.5,-1.5; N7 -4.5,-1.5; N8 -3.5,-1.5; N9 -2.5,-1.5; N10 -1.5,-1.5; N11 -0.5,-1.5; N12 0.5,-1.5; N13 1.5,-1.5; N14 2.5,-1.5; N15 3.5,-1.5; N16 4.5,-1.5; N17 5.5,-1.5; N18 6.5,-1.5; N19 7.5,-1.5; N20 8.5,-1.5; N21 9.5,-1.5; N22 10.5,-1.5; P1 -10.5,-2.5; P2 -9.5,-2.5; P3 -8.5,-2.5; P4 -7.5,-2.5; P5 -6.5,-2.5; P6 -5.5,-2.5; P7 -4.5,-2.5; P8 -3.5,-2.5; P9 -2.5,-2.5; P10 -1.5,-2.5; P11 -0.5,-2.5; P12 0.5,-2.5; P13 1.5,-2.5; P14 2.5,-2.5; P15 3.5,-2.5; P16 4.5,-2.5; P17 5.5,-2.5; P18 6.5,-2.5; P19 7.5,-2.5; P20 8.5,-2.5; P21 9.5,-2.5; P22 10.5,-2.5; R1 -10.5,-3.5; R2 -9.5,-3.5; R3 -8.5,-3.5; R4 -7.5,-3.5; R5 -6.5,-3.5; R6 -5.5,-3.5; R7 -4.5,-3.5; R8 -3.5,-3.5; R9 -2.5,-3.5; R10 -1.5,-3.5; R11 -0.5,-3.5; R12 0.5,-3.5; R13 1.5,-3.5; R14 2.5,-3.5; R15 3.5,-3.5; R16 4.5,-3.5; R17 5.5,-3.5; R18 6.5,-3.5; R19 7.5,-3.5; R20 8.5,-3.5; R21 9.5,-3.5; R22 10.5,-3.5; T1 -10.5,-4.5; T2 -9.5,-4.5; T3 -8.5,-4.5; T4 -7.5,-4.5; T5 -6.5,-4.5; T6 -5.5,-4.5; T7 -4.5,-4.5; T8 -3.5,-4.5; T9 -2.5,-4.5; T10 -1.5,-4.5; T11 -0.5,-4.5; T12 0.5,-4.5; T13 1.5,-4.5; T14 2.5,-4.5; T15 3.5,-4.5; T16 4.5,-4.5; T17 5.5,-4.5; T18 6.5,-4.5; T19 7.5,-4.5; T20 8.5,-4.5; T21 9.5,-4.5; T22 10.5,-4.5; U1 -10.5,-5.5; U2 -9.5,-5.5; U3 -8.5,-5.5; U4 -7.5,-5.5; U5 -6.5,-5.5; U6 -5.5,-5.5; U7 -4.5,-5.5; U8 -3.5,-5.5; U9 -2.5,-5.5; U10 -1.5,-5.5; U11 -0.5,-5.5; U12 0.5,-5.5; U13 1.5,-5.5; U14 2.5,-5.5; U15 3.5,-5.5; U16 4.5,-5.5; U17 5.5,-5.5; U18 6.5,-5.5; U19 7.5,-5.5; U20 8.5,-5.5; U21 9.5,-5.5; U22 10.5,-5.5; V1 -10.5,-6.5; V2 -9.5,-6.5; V3 -8.5,-6.5; V4 -7.5,-6.5; V5 -6.5,-6.5; V6 -5.5,-6.5; V7 -4.5,-6.5; V8 -3.5,-6.5; V9 -2.5,-6.5; V10 -1.5,-6.5; V11 -0.5,-6.5; V12 0.5,-6.5; V13 1.5,-6.5; V14 2.5,-6.5; V15 3.5,-6.5; V16 4.5,-6.5; V17 5.5,-6.5; V18 6.5,-6.5; V19 7.5,-6.5; V20 8.5,-6.5; V21 9.5,-6.5; V22 10.5,-6.5; W1 -10.5,-7.5; W2 -9.5,-7.5; W3 -8.5,-7.5; W4 -7.5,-7.5; W5 -6.5,-7.5; W6 -5.5,-7.5; W7 -4.5,-7.5; W8 -3.5,-7.5; W9 -2.5,-7.5; W10 -1.5,-7.5; W11 -0.5,-7.5; W12 0.5,-7.5; W13 1.5,-7.5; W14 2.5,-7.5; W15 3.5,-7.5; W16 4.5,-7.5; W17 5.5,-7.5; W18 6.5,-7.5; W19 7.5,-7.5; W20 8.5,-7.5; W21 9.5,-7.5; W22 10.5,-7.5; Y1 -10.5,-8.5; Y2 -9.5,-8.5; Y3 -8.5,-8.5; Y4 -7.5,-8.5; Y5 -6.5,-8.5; Y6 -5.5,-8.5; Y7 -4.5,-8.5; Y8 -3.5,-8.5; Y9 -2.5,-8.5; Y10 -1.5,-8.5; Y11 -0.5,-8.5; Y12 0.5,-8.5; Y13 1.5,-8.5; Y14 2.5,-8.5; Y15 3.5,-8.5; Y16 4.5,-8.5; Y17 5.5,-8.5; Y18 6.5,-8.5; Y19 7.5,-8.5; Y20 8.5,-8.5; Y21 9.5,-8.5; Y22 10.5,-8.5
WSOIC8 = smd 0.6 x 2.2: 1 -1.905,-3.33; 2 -0.635,-3.33; 3 0.635,-3.33; 4 1.905,-3.33; 5 1.905,3.33; 6 0.635,3.33; 7 -0.635,3.33; 8 -1.905,3.33
FBGA96_14X8 = smd 0.42 x 0.42: A1 -3.2,6; A2 -2.4,6; A3 -1.6,6; A7 1.6,6; A8 2.4,6; A9 3.2,6; B1 -3.2,5.2; B2 -2.4,5.2; B3 -1.6,5.2; B7 1.6,5.2; B8 2.4,5.2; B9 3.2,5.2; C1 -3.2,4.4; C2 -2.4,4.4; C3 -1.6,4.4; C7 1.6,4.4; C8 2.4,4.4; C9 3.2,4.4; D1 -3.2,3.6; D2 -2.4,3.6; D3 -1.6,3.6; D7 1.6,3.6; D8 2.4,3.6; D9 3.2,3.6; E1 -3.2,2.8; E2 -2.4,2.8; E3 -1.6,2.8; E7 1.6,2.8; E8 2.4,2.8; E9 3.2,2.8; F1 -3.2,2; F2 -2.4,2; F3 -1.6,2; F7 1.6,2; F8 2.4,2; F9 3.2,2; G1 -3.2,1.2; G2 -2.4,1.2; G3 -1.6,1.2; G7 1.6,1.2; G8 2.4,1.2; G9 3.2,1.2; H1 -3.2,0.4; H2 -2.4,0.4; H3 -1.6,0.4; H7 1.6,0.4; H8 2.4,0.4; H9 3.2,0.4; J1 -3.2,-0.4; J2 -2.4,-0.4; J3 -1.6,-0.4; J7 1.6,-0.4; J8 2.4,-0.4; J9 3.2,-0.4; K1 -3.2,-1.2; K2 -2.4,-1.2; K3 -1.6,-1.2; K7 1.6,-1.2; K8 2.4,-1.2; K9 3.2,-1.2; L1 -3.2,-2; L2 -2.4,-2; L3 -1.6,-2; L7 1.6,-2; L8 2.4,-2; L9 3.2,-2; M1 -3.2,-2.8; M2 -2.4,-2.8; M3 -1.6,-2.8; M7 1.6,-2.8; M8 2.4,-2.8; M9 3.2,-2.8; N1 -3.2,-3.6; N2 -2.4,-3.6; N3 -1.6,-3.6; N7 1.6,-3.6; N8 2.4,-3.6; N9 3.2,-3.6; P1 -3.2,-4.4; P2 -2.4,-4.4; P3 -1.6,-4.4; P7 1.6,-4.4; P8 2.4,-4.4; P9 3.2,-4.4; R1 -3.2,-5.2; R2 -2.4,-5.2; R3 -1.6,-5.2; R7 1.6,-5.2; R8 2.4,-5.2; R9 3.2,-5.2; T1 -3.2,-6; T2 -2.4,-6; T3 -1.6,-6; T7 1.6,-6; T8 2.4,-6; T9 3.2,-6
BGA144 = smd 0.356 x 0.356: A1 -4.4,4.4; A2 -3.6,4.4; A3 -2.8,4.4; A4 -2,4.4; A5 -1.2,4.4; A6 -0.4,4.4; A7 0.4,4.4; A8 1.2,4.4; A9 2,4.4; A10 2.8,4.4; A11 3.6,4.4; A12 4.4,4.4; B1 -4.4,3.6; B2 -3.6,3.6; B3 -2.8,3.6; B4 -2,3.6; B5 -1.2,3.6; B6 -0.4,3.6; B7 0.4,3.6; B8 1.2,3.6; B9 2,3.6; B10 2.8,3.6; B11 3.6,3.6; B12 4.4,3.6; C1 -4.4,2.8; C2 -3.6,2.8; C3 -2.8,2.8; C4 -2,2.8; C5 -1.2,2.8; C6 -0.4,2.8; C7 0.4,2.8; C8 1.2,2.8; C9 2,2.8; C10 2.8,2.8; C11 3.6,2.8; C12 4.4,2.8; D1 -4.4,2; D2 -3.6,2; D3 -2.8,2; D4 -2,2; D5 -1.2,2; D6 -0.4,2; D7 0.4,2; D8 1.2,2; D9 2,2; D10 2.8,2; D11 3.6,2; D12 4.4,2; E1 -4.4,1.2; E2 -3.6,1.2; E3 -2.8,1.2; E4 -2,1.2; E5 -1.2,1.2; E6 -0.4,1.2; E7 0.4,1.2; E8 1.2,1.2; E9 2,1.2; E10 2.8,1.2; E11 3.6,1.2; E12 4.4,1.2; F1 -4.4,0.4; F2 -3.6,0.4; F3 -2.8,0.4; F4 -2,0.4; F5 -1.2,0.4; F6 -0.4,0.4; F7 0.4,0.4; F8 1.2,0.4; F9 2,0.4; F10 2.8,0.4; F11 3.6,0.4; F12 4.4,0.4; G1 -4.4,-0.4; G2 -3.6,-0.4; G3 -2.8,-0.4; G4 -2,-0.4; G5 -1.2,-0.4; G6 -0.4,-0.4; G7 0.4,-0.4; G8 1.2,-0.4; G9 2,-0.4; G10 2.8,-0.4; G11 3.6,-0.4; G12 4.4,-0.4; H1 -4.4,-1.2; H2 -3.6,-1.2; H3 -2.8,-1.2; H4 -2,-1.2; H5 -1.2,-1.2; H6 -0.4,-1.2; H7 0.4,-1.2; H8 1.2,-1.2; H9 2,-1.2; H10 2.8,-1.2; H11 3.6,-1.2; H12 4.4,-1.2; J1 -4.4,-2; J2 -3.6,-2; J3 -2.8,-2; J4 -2,-2; J5 -1.2,-2; J6 -0.4,-2; J7 0.4,-2; J8 1.2,-2; J9 2,-2; J10 2.8,-2; J11 3.6,-2; J12 4.4,-2; K1 -4.4,-2.8; K2 -3.6,-2.8; K3 -2.8,-2.8; K4 -2,-2.8; K5 -1.2,-2.8; K6 -0.4,-2.8; K7 0.4,-2.8; K8 1.2,-2.8; K9 2,-2.8; K10 2.8,-2.8; K11 3.6,-2.8; K12 4.4,-2.8; L1 -4.4,-3.6; L2 -3.6,-3.6; L3 -2.8,-3.6; L4 -2,-3.6; L5 -1.2,-3.6; L6 -0.4,-3.6; L7 0.4,-3.6; L8 1.2,-3.6; L9 2,-3.6; L10 2.8,-3.6; L11 3.6,-3.6; L12 4.4,-3.6; M1 -4.4,-4.4; M2 -3.6,-4.4; M3 -2.8,-4.4; M4 -2,-4.4; M5 -1.2,-4.4; M6 -0.4,-4.4; M7 0.4,-4.4; M8 1.2,-4.4; M9 2,-4.4; M10 2.8,-4.4; M11 3.6,-4.4; M12 4.4,-4.4
SOT89 = smd 0.9 x 1.3: 1 -1.5,-1.562; 3 1.5,-1.562 | smd 0.9 x 1.5: 2 0,-1.462 | smd 1.733 x 3.5: 4 0,0.988
VFQFPN48 = smd 0.7 x 0.25: 1 -3.45,2.75; 2 -3.45,2.25; 3 -3.45,1.75; 4 -3.45,1.25; 5 -3.45,0.75; 6 -3.45,0.25; 7 -3.45,-0.25; 8 -3.45,-0.75; 9 -3.45,-1.25; 10 -3.45,-1.75; 11 -3.45,-2.25; 12 -3.45,-2.75; 25 3.45,-2.75; 26 3.45,-2.25; 27 3.45,-1.75; 28 3.45,-1.25; 29 3.45,-0.75; 30 3.45,-0.25; 31 3.45,0.25; 32 3.45,0.75; 33 3.45,1.25; 34 3.45,1.75; 35 3.45,2.25; 36 3.45,2.75 | smd 0.25 x 0.7: 13 -2.75,-3.45; 14 -2.25,-3.45; 15 -1.75,-3.45; 16 -1.25,-3.45; 17 -0.75,-3.45; 18 -0.25,-3.45; 19 0.25,-3.45; 20 0.75,-3.45; 21 1.25,-3.45; 22 1.75,-3.45; 23 2.25,-3.45; 24 2.75,-3.45; 37 2.75,3.45; 38 2.25,3.45; 39 1.75,3.45; 40 1.25,3.45; 41 0.75,3.45; 42 0.25,3.45; 43 -0.25,3.45; 44 -0.75,3.45; 45 -1.25,3.45; 46 -1.75,3.45; 47 -2.25,3.45; 48 -2.75,3.45 | smd 5.3 x 5.3: 49 0,0
QFN40 = smd 0.9 x 0.29: 1 -3.05,2.25; 2 -3.05,1.75; 3 -3.05,1.25; 4 -3.05,0.75; 5 -3.05,0.25; 6 -3.05,-0.25; 7 -3.05,-0.75; 8 -3.05,-1.25; 9 -3.05,-1.75; 10 -3.05,-2.25; 21 3.05,-2.25; 22 3.05,-1.75; 23 3.05,-1.25; 24 3.05,-0.75; 25 3.05,-0.25; 26 3.05,0.25; 27 3.05,0.75; 28 3.05,1.25; 29 3.05,1.75; 30 3.05,2.25 | smd 0.29 x 0.9: 11 -2.25,-3.05; 12 -1.75,-3.05; 13 -1.25,-3.05; 14 -0.75,-3.05; 15 -0.25,-3.05; 16 0.25,-3.05; 17 0.75,-3.05; 18 1.25,-3.05; 19 1.75,-3.05; 20 2.25,-3.05; 31 2.25,3.05; 32 1.75,3.05; 33 1.25,3.05; 34 0.75,3.05; 35 0.25,3.05; 36 -0.25,3.05; 37 -0.75,3.05; 38 -1.25,3.05; 39 -1.75,3.05; 40 -2.25,3.05 | smd 4.1 x 4.1: 41 0,0
TCXO-3225 = smd 0.78 x 0.9: 1 -1.6,-0.7; 2 1.6,-0.7; 3 1.6,0.7; 4 -1.6,0.7
QFN20 = smd 0.75 x 0.3: 1 -2,1; 2 -2,0.5; 3 -2,0; 4 -2,-0.5; 5 -2,-1; 11 2,-1; 12 2,-0.5; 13 2,0; 14 2,0.5; 15 2,1 | smd 0.3 x 0.75: 6 -1,-2; 7 -0.5,-2; 8 0,-2; 9 0.5,-2; 10 1,-2; 16 1,2; 17 0.5,2; 18 0,2; 19 -0.5,2; 20 -1,2 | smd 2.6 x 2.6: 21 0,0
DFN8 = smd 0.8 x 0.25: 1 -1.45,0.75; 2 -1.45,0.25; 3 -1.45,-0.25; 4 -1.45,-0.75; 5 1.45,-0.75; 6 1.45,-0.25; 7 1.45,0.25; 8 1.45,0.75 | smd 1.65 x 2.38: 9 0,0
VQFN40 = smd 0.8 x 0.3: 1 -3,2.25; 2 -3,1.75; 3 -3,1.25; 4 -3,0.75; 5 -3,0.25; 6 -3,-0.25; 7 -3,-0.75; 8 -3,-1.25; 9 -3,-1.75; 10 -3,-2.25; 21 3,-2.25; 22 3,-1.75; 23 3,-1.25; 24 3,-0.75; 25 3,-0.25; 26 3,0.25; 27 3,0.75; 28 3,1.25; 29 3,1.75; 30 3,2.25 | smd 0.3 x 0.8: 11 -2.25,-3; 12 -1.75,-3; 13 -1.25,-3; 14 -0.75,-3; 15 -0.25,-3; 16 0.25,-3; 17 0.75,-3; 18 1.25,-3; 19 1.75,-3; 20 2.25,-3; 31 2.25,3; 32 1.75,3; 33 1.25,3; 34 0.75,3; 35 0.25,3; 36 -0.25,3; 37 -0.75,3; 38 -1.25,3; 39 -1.75,3; 40 -2.25,3 | smd 4.7 x 4.7: 41 0,0
SOT23-5 = smd 1 x 0.55: 1 -1.4,0.95; 2 -1.4,0; 3 -1.4,-0.95; 4 1.4,-0.95; 5 1.4,0.95
LQFN40_ASYM_CORNER = smd 0.7 x 0.25: 1 -2.4,2.75; 2 -2.4,2.25; 3 -2.4,1.75; 4 -2.4,1.25; 5 -2.4,0.75; 6 -2.4,0.25; 7 -2.4,-0.25; 8 -2.4,-0.75; 9 -2.4,-1.25; 10 -2.4,-1.75; 11 -2.4,-2.25; 12 -2.4,-2.75; 21 2.4,-2.75; 22 2.4,-2.25; 23 2.4,-1.75; 24 2.4,-1.25; 25 2.4,-0.75; 26 2.4,-0.25; 27 2.4,0.25; 28 2.4,0.75; 29 2.4,1.25; 30 2.4,1.75; 31 2.4,2.25; 32 2.4,2.75 | smd 0.25 x 0.7: 13 -1.75,-3.4; 14 -1.25,-3.4; 15 -0.75,-3.4; 16 -0.25,-3.4; 17 0.25,-3.4; 18 0.75,-3.4; 19 1.25,-3.4; 20 1.75,-3.4; 33 1.75,3.4; 34 1.25,3.4; 35 0.75,3.4; 36 0.25,3.4; 37 -0.25,3.4; 38 -0.75,3.4; 39 -1.25,3.4; 40 -1.75,3.4 | smd 1.5 x 1.275: 41 0,2.212; 44 0,-2.212 | smd 1.575 x 2.65: 42 -0.912,0.013; 43 0.912,0.013 | smd 0.375 x 0.375: 45 -2.312,3.312; 46 2.312,3.312; 47 2.312,-3.312; 48 -2.312,-3.312
LFCSP8_3X3 = smd 0.8 x 0.3: 1 -1.315,0.75; 2 -1.315,0.25; 3 -1.315,-0.25; 4 -1.315,-0.75; 5 1.315,-0.75; 6 1.315,-0.25; 7 1.315,0.25; 8 1.315,0.75 | smd 1.4 x 2.36: 9 0,0
VQFN20 = smd 0.6 x 0.25: 1 -1.5,1.25; 2 -1.5,0.75; 3 -1.5,0.25; 4 -1.5,-0.25; 5 -1.5,-0.75; 6 -1.5,-1.25; 11 1.5,-1.25; 12 1.5,-0.75; 13 1.5,-0.25; 14 1.5,0.25; 15 1.5,0.75; 16 1.5,1.25 | smd 0.25 x 0.6: 7 -0.75,-2; 8 -0.25,-2; 9 0.25,-2; 10 0.75,-2; 17 0.75,2; 18 0.25,2; 19 -0.25,2; 20 -0.75,2 | smd 1.6 x 2.6: 21 0,0
DFN10 = smd 0.48 x 0.26: 1 -1.36,1; 2 -1.36,0.5; 3 -1.36,0; 4 -1.36,-0.5; 5 -1.36,-1; 6 1.36,-1; 7 1.36,-0.5; 8 1.36,0; 9 1.36,0.5; 10 1.36,1 | smd 1.7 x 2.5: 11 0,0
DFN10_0.65P = smd 0.6 x 0.25: 1 -1.25,1; 2 -1.25,0.5; 3 -1.25,0; 4 -1.25,-0.5; 5 -1.25,-1; 6 1.25,-1; 7 1.25,-0.5; 8 1.25,0; 9 1.25,0.5; 10 1.25,1 | smd 1.2 x 1.9: 11 0,0
USB-C-16P-SMD-FLAT-SIDE-TYPE-2 = smd 1.25 x 0.6: A1/B12 5,3.2; A4/B9 5,2.4; B1/A12 5,-3.2; B4/A9 5,-2.4 | smd 1.25 x 0.3: A5 5,1.25; A6 5,0.25; A7 5,-0.25; A8 5,-1.25; B5 5,-1.75; B6 5,-0.75; B7 5,0.75; B8 5,1.75 | drill 0.6 pad 1 long: SHIELD@0 0,4.32; SHIELD@1 4.18,4.32; SHIELD@2 4.18,-4.32; SHIELD@3 0,-4.32 | hole 0.65: 3.68,2.89; 3.68,-2.89